# EAGLE design FPC-EMC01-1284 (EAGLE 7.2.0)

## Sheet 1 of 2
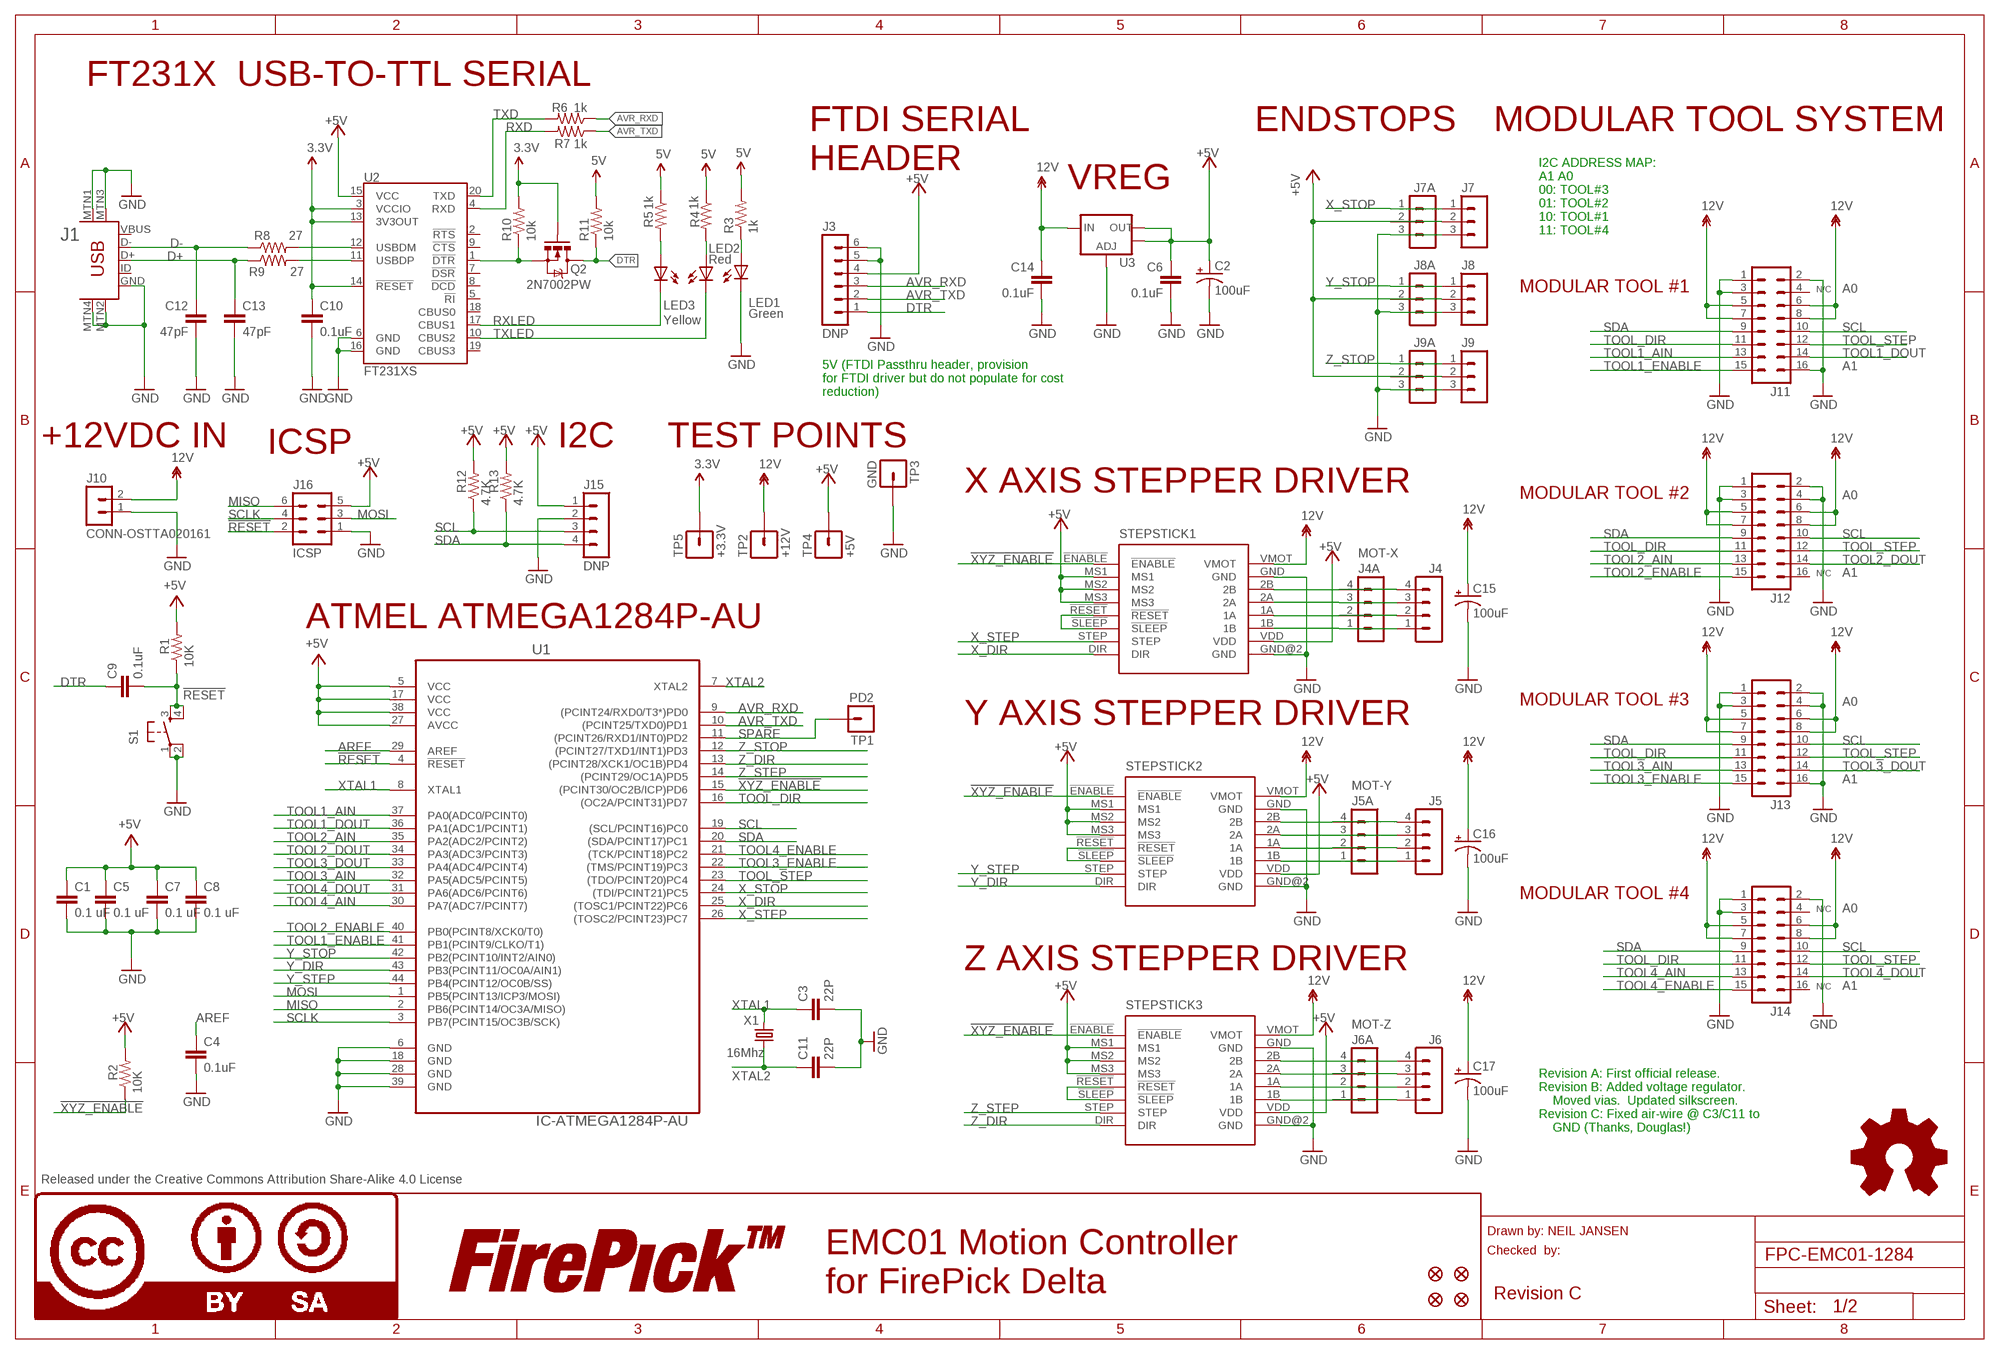
[diagram p0: schematic, sheet 1]

### Parts
C1  0.1 uF  CAP0805  [0805]
C2  100uF  CPOL-USD  [PANASONIC_D]
C3  22P  CAP0805  [0805]
C4  0.1uF  CAP0805  [0805]
C5  0.1 uF  CAP0805  [0805]
C6  0.1uF  CAP0805  [0805]
C7  0.1 uF  CAP0805  [0805]
C8  0.1 uF  CAP0805  [0805]
C9  0.1uF  CAP0805  [0805]
C10  0.1uF  CAP0805  [0805]
C11  22P  CAP0805  [0805]
C12  47pF  CAP0805  [0805]
C13  47pF  CAP0805  [0805]
C14  0.1uF  CAP0805  [0805]
C15  100uF  CPOL-USD  [PANASONIC_D]
C16  100uF  CPOL-USD  [PANASONIC_D]
C17  100uF  CPOL-USD  [PANASONIC_D]
FID1  FIDUCIAL1X2  [FIDUCIAL-1X2]
FID2  FIDUCIAL1X2  [FIDUCIAL-1X2]
FID3  FIDUCIAL1X2  [FIDUCIAL-1X2]
FID4  FIDUCIAL1X2  [FIDUCIAL-1X2]
J1  USB-MINIB-5PIN  [USB-MINIB]
J3  DNP  MA06-1  [MA06-1]
J4  MA04-1  [MA04-1]
J4A  MOT-X  CONN-RECT-4PINJST-PH-2MM  [CONN-JST-PH_2.0MM_4PIN-SMT-RA]
J5  MA04-1  [MA04-1]
J5A  MOT-Y  CONN-RECT-4PINJST-PH-2MM  [CONN-JST-PH_2.0MM_4PIN-SMT-RA]
J6  MA04-1  [MA04-1]
J6A  MOT-Z  CONN-RECT-4PINJST-PH-2MM  [CONN-JST-PH_2.0MM_4PIN-SMT-RA]
J7  MA03-1  [MA03-1]
J7A  CONN-RECT-3PINJST_PH_2MM  [CONN-JST_PH-2.0MM-3PIN-SMT-RA]
J8  MA03-1  [MA03-1]
J8A  CONN-RECT-3PINJST_PH_2MM  [CONN-JST_PH-2.0MM-3PIN-SMT-RA]
J9  MA03-1  [MA03-1]
J9A  CONN-RECT-3PINJST_PH_2MM  [CONN-JST_PH-2.0MM-3PIN-SMT-RA]
J10  CONN-OSTTA020161  [CONN-OSTTA020161]
J11  CONN-RECT-16PIN-2ROW  [CONN-RECT-2.54MM-16PIN-2ROW-SMTH]
J12  CONN-RECT-16PIN-2ROW  [CONN-RECT-2.54MM-16PIN-2ROW-SMTH]
J13  CONN-RECT-16PIN-2ROW  [CONN-RECT-2.54MM-16PIN-2ROW-SMTH]
J14  CONN-RECT-16PIN-2ROW  [CONN-RECT-2.54MM-16PIN-2ROW-SMTH]
J15  DNP  MA04-1  [MA04-1]
J16  ICSP  CONN-RECT-6PIN-2ROW  [CONN-RECT-2.54MM-6-PIN-2ROW-SMTH]
LED1  Green  LED1206-NS  [LED-1206-NO_SILK]
LED2  Red  LED1206-NS  [LED-1206-NO_SILK]
LED3  Yellow  LED1206-NS  [LED-1206-NO_SILK]
LOGO4  LOGO-FIREPICK  [LOGO-FIREPICK]
LOGO5  LOGO-OSHWMEDIUM  [LOGO-OSHW-MEDIUM]
LOGO6  LOGO-CC-BY-SA  [LOGO-CC-BY-SA]
Q2  2N7002PW  MOSFET-NCHANNEL2N7002PW  [SOT323]
R1  10K  RESISTOR0805-RES  [0805]
R2  10K  RESISTOR0805-RES  [0805]
R3  1k  RESISTOR0805-RES  [0805]
R4  1k  RESISTOR0805-RES  [0805]
R5  1k  RESISTOR0805-RES  [0805]
R6  1k  RESISTOR0805-RES  [0805]
R7  1k  RESISTOR0805-RES  [0805]
R8  27  RESISTOR0805-RES  [0805]
R9  27  RESISTOR0805-RES  [0805]
R10  10k  RESISTOR0805-RES  [0805]
R11  10k  RESISTOR0805-RES  [0805]
R12  4.7K  RESISTOR0805-RES  [0805]
R13  4.7K  RESISTOR0805-RES  [0805]
S1  TAC_SWITCHSMD  [TACTILE_SWITCH_SMD]
STEPSTICK1  STEPSTICK  [STEPSTICK]
STEPSTICK2  STEPSTICK  [STEPSTICK]
STEPSTICK3  STEPSTICK  [STEPSTICK]
TP1  PD2  CONN-TESTPOINT  [CON-TESTPOINT]
TP2  +12V  CONN-TESTPOINT  [CON-TESTPOINT]
TP3  GND  CONN-TESTPOINT  [CON-TESTPOINT]
TP4  +5V  CONN-TESTPOINT  [CON-TESTPOINT]
TP5  +3.3V  CONN-TESTPOINT  [CON-TESTPOINT]
U1  IC-ATMEGA1284P-AU  [QFP44]
U2  FT231XS  [SSOP20_L]
U3  V_REG_LM1117SOT223  [SOT223]
X1  16Mhz  CRYSTALCTS406  [CTS406]

### Nets
3.3V: C10.1 Q2.1(G) R10.2 TP5.1 U2.3(VCCIO) U2.13(3V3OUT) U2.14(!RESET)
12V: C14.1 C15.+ C16.+ C17.+ J10.2 J11.5 J11.6 J11.7 J11.8 J12.5 J12.6 J12.7 J12.8 J13.5 J13.6 J13.7 J13.8 J14.5 J14.6 J14.7 J14.8 STEPSTICK1.VMOT STEPSTICK2.VMOT STEPSTICK3.VMOT TP2.1 U3.3(IN)
!RESET: C9.2 J16.2 R1.1 S1.3 S1.4 U1.4(!RESET)
!XYZ_ENABLE: R2.1 STEPSTICK1.!ENABLE! STEPSTICK2.!ENABLE! STEPSTICK3.!ENABLE! U1.15((PCINT30/OC2B/ICP)PD6)
+5V [power]: C1.1 C2.+ C5.1 C6.1 C7.1 C8.1 J3.4 J7.2 J7A.2 J8.2 J8A.2 J9.2 J9A.2 J15.1 J16.5 R1.2 R2.2 R3.2 R4.1 R5.1 R11.2 R12.2 R13.2 STEPSTICK1.MS1 STEPSTICK1.MS2 STEPSTICK1.MS3 STEPSTICK1.VDD STEPSTICK2.MS1 STEPSTICK2.MS2 STEPSTICK2.MS3 STEPSTICK2.VDD STEPSTICK3.MS1 STEPSTICK3.MS2 STEPSTICK3.MS3 STEPSTICK3.VDD TP4.1 U1.5(VCC) U1.17(VCC) U1.27(AVCC) U1.38(VCC) U2.15(VCC) U3.2(OUT) U3.4(OUT) ; supply symbol labelled 5V
AREF: C4.1 U1.29(AREF)
AVR_RXD: J3.3 R6.1 U1.9((PCINT24/RXD0/T3*)PD0)
AVR_TXD: J3.2 R7.1 U1.10((PCINT25/TXD0)PD1)
D+: C13.1 J1.D+ R9.1
D-: C12.1 J1.D- R8.1
DTR: C9.1 J3.1 Q2.3(D) R11.1
DTR_3.3V: Q2.2(S) R10.1 U2.1(!DTR)
GND [power]: C1.2 C2.- C3.2 C4.2 C5.2 C6.2 C7.2 C8.2 C10.2 C11.2 C12.2 C13.2 C14.2 C15.- C16.- C17.- J1.GND J1.MTN1(MTN2) J1.MTN2(MTN3) J1.MTN3(MTN1) J1.MTN4 J3.5 J3.6 J7.3 J7A.3 J8.3 J8A.3 J9.3 J9A.3 J10.1 J11.1 J11.2 J11.3 J11.16 J12.1 J12.2 J12.3 J12.4 J13.1 J13.2 J13.3 J13.4 J13.16 J14.1 J14.2 J14.3 J15.2 J16.1 LED1.C S1.1 S1.2 STEPSTICK1.GND STEPSTICK1.GND@2(GND) STEPSTICK2.GND STEPSTICK2.GND@2(GND) STEPSTICK3.GND STEPSTICK3.GND@2(GND) TP3.1 U1.6(GND) U1.18(GND) U1.28(GND) U1.39(GND) U2.6(GND) U2.16(GND) U3.1(ADJ)
MISO: J16.6 U1.2(PB6(PCINT14/OC3A/MISO))
MOSI: J16.3 U1.1(PB5(PCINT13/ICP3/MOSI))
N$4: LED1.A R3.1
N$11: STEPSTICK1.!RESET! STEPSTICK1.!SLEEP!
N$16: STEPSTICK2.!RESET! STEPSTICK2.!SLEEP!
N$21: LED2.A R4.2
N$22: LED3.A R5.2
N$23: R8.2 U2.12(USBDM)
N$24: STEPSTICK3.!RESET! STEPSTICK3.!SLEEP!
N$25: R9.2 U2.11(USBDP)
RXD: R7.2 U2.4(RXD)
RXLED: LED3.C U2.17(CBUS1)
SCL [power]: J11.10 J12.10 J13.10 J14.10 J15.3 R12.1 U1.19((SCL/PCINT16)PC0)
SCLK: J16.4 U1.3(PB7(PCINT15/OC3B/SCK))
SDA [power]: J11.9 J12.9 J13.9 J14.9 J15.4 R13.1 U1.20((SDA/PCINT17)PC1)
SPARE: TP1.1 U1.11((PCINT26/RXD1/INT0)PD2)
TOOL1_AIN: J11.13 U1.37(PA0(ADC0/PCINT0))
TOOL1_DOUT: J11.14 U1.36(PA1(ADC1/PCINT1))
TOOL1_ENABLE: J11.15 U1.41(PB1(PCINT9/CLKO/T1))
TOOL2_AIN: J12.13 U1.35(PA2(ADC2/PCINT2))
TOOL2_DOUT: J12.14 U1.34(PA3(ADC3/PCINT3))
TOOL2_ENABLE: J12.15 U1.40(PB0(PCINT8/XCK0/T0))
TOOL3_AIN: J13.13 U1.32(PA5(ADC5/PCINT5))
TOOL3_DOUT: J13.14 U1.33(PA4(ADC4/PCINT4))
TOOL3_ENABLE: J13.15 U1.22((TMS/PCINT19)PC3)
TOOL4_AIN: J14.13 U1.30(PA7(ADC7/PCINT7))
TOOL4_DOUT: J14.14 U1.31(PA6(ADC6/PCINT6))
TOOL4_ENABLE: J14.15 U1.21((TCK/PCINT18)PC2)
TOOL_DIR: J11.11 J12.11 J13.11 J14.11 U1.16((OC2A/PCINT31)PD7)
TOOL_STEP: J11.12 J12.12 J13.12 J14.12 U1.23((TDO/PCINT20)PC4)
TXD: R6.2 U2.20(TXD)
TXLED: LED2.C U2.10(CBUS2)
X1A: J4.2 J4A.2 STEPSTICK1.1A
X1B: J4.1 J4A.1 STEPSTICK1.1B
X2A: J4.3 J4A.3 STEPSTICK1.2A
X2B: J4.4 J4A.4 STEPSTICK1.2B
X_DIR: STEPSTICK1.DIR U1.25((TOSC1/PCINT22)PC6)
X_STEP: STEPSTICK1.STEP U1.26((TOSC2/PCINT23)PC7)
X_STOP: J7.1 J7A.1 U1.24((TDI/PCINT21)PC5)
XTAL1: C3.1 U1.8(XTAL1) X1.3
XTAL2: C11.1 U1.7(XTAL2) X1.1
Y1A: J5.2 J5A.2 STEPSTICK2.1A
Y1B: J5.1 J5A.1 STEPSTICK2.1B
Y2A: J5.3 J5A.3 STEPSTICK2.2A
Y2B: J5.4 J5A.4 STEPSTICK2.2B
Y_DIR: STEPSTICK2.DIR U1.43(PB3(PCINT11/OC0A/AIN1))
Y_STEP: STEPSTICK2.STEP U1.44(PB4(PCINT12/OC0B/SS))
Y_STOP: J8.1 J8A.1 U1.42(PB2(PCINT10/INT2/AIN0))
Z1A: J6.2 J6A.2 STEPSTICK3.1A
Z1B: J6.1 J6A.1 STEPSTICK3.1B
Z2A: J6.3 J6A.3 STEPSTICK3.2A
Z2B: J6.4 J6A.4 STEPSTICK3.2B
Z_DIR: STEPSTICK3.DIR U1.13((PCINT28/XCK1/OC1B)PD4)
Z_STEP: STEPSTICK3.STEP U1.14((PCINT29/OC1A)PD5)
Z_STOP: J9.1 J9A.1 U1.12((PCINT27/TXD1/INT1)PD3)
Unconnected: J1.ID J1.VBUS J11.4 J12.16 J14.4 J14.16 U2.2(!RTS) U2.5(!RI) U2.7(!DSR) U2.8(!DCD) U2.9(!CTS) U2.18(CBUS0) U2.19(CBUS3)

### Notes on the sheet
- FT231X  USB-TO-TTL SERIAL
- ENDSTOPS | MODULAR TOOL SYSTEM
- FTDI SERIAL 
  HEADER
- VREG
- I2C ADDRESS MAP:
  A1 A0
  00: TOOL#3
  01: TOOL#2
  10: TOOL#1
  11: TOOL#4
- J1
- MODULAR TOOL #1 | N/C | A0
- A1
- 5V (FTDI Passthru header, provision
  for FTDI driver but do not populate for cost
  reduction)
- +12VDC IN | ICSP | I2C | TEST POINTS
- X AXIS STEPPER DRIVER
- MODULAR TOOL #2 | A0
- N/C | A1
- ATMEL ATMEGA1284P-AU
- MODULAR TOOL #3 | A0
- Y AXIS STEPPER DRIVER
- A1
- MODULAR TOOL #4
- N/C | A0
- Z AXIS STEPPER DRIVER
- N/C | A1
- Revision A: First official release.
  Revision B: Added voltage regulator.  
      Moved vias.  Updated silkscreen.
  Revision C: Fixed air-wire @ C3/C11 to 
      GND (Thanks, Douglas!)
- Released under the Creative Commons Attribution Share-Alike 4.0 License
- Drawn by: NEIL JANSEN
- Checked  by:
- EMC01 Motion Controller
  for FirePick Delta
- Revision C

## Sheet 2 of 2
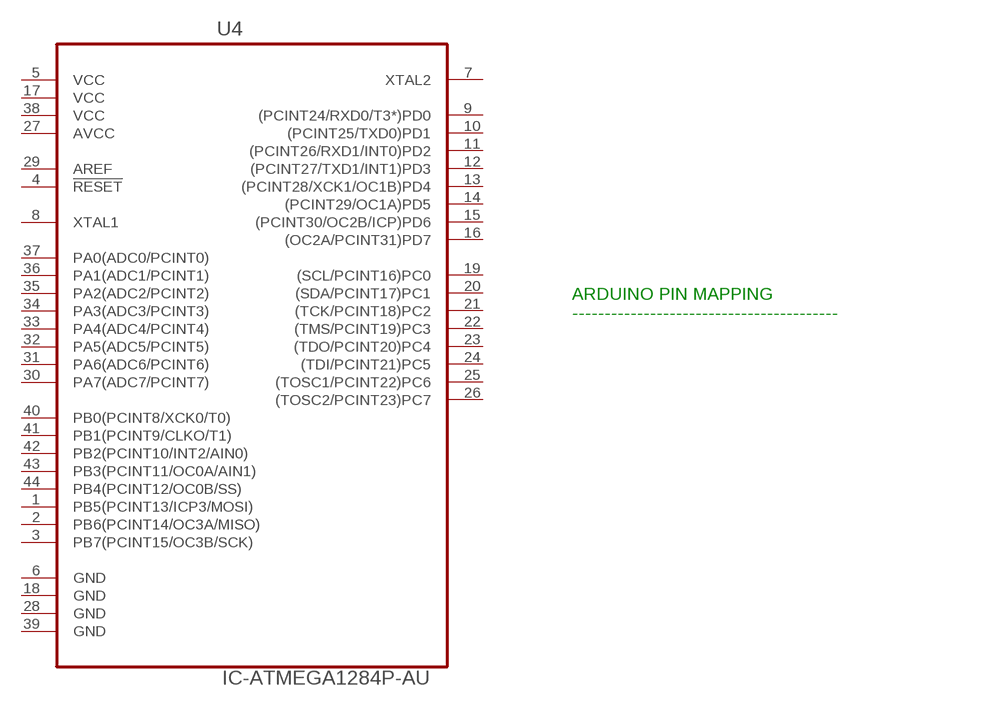
[diagram p1: schematic, sheet 2]

### Parts
U4  IC-ATMEGA1284P-AU  [QFP44]
Unconnected: U4.1(PB5(PCINT13/ICP3/MOSI)) U4.2(PB6(PCINT14/OC3A/MISO)) U4.3(PB7(PCINT15/OC3B/SCK)) U4.4(!RESET) U4.6(GND) U4.7(XTAL2) U4.8(XTAL1) U4.9((PCINT24/RXD0/T3*)PD0) U4.10((PCINT25/TXD0)PD1) U4.11((PCINT26/RXD1/INT0)PD2) U4.12((PCINT27/TXD1/INT1)PD3) U4.13((PCINT28/XCK1/OC1B)PD4) U4.14((PCINT29/OC1A)PD5) U4.15((PCINT30/OC2B/ICP)PD6) U4.16((OC2A/PCINT31)PD7) U4.18(GND) U4.19((SCL/PCINT16)PC0) U4.20((SDA/PCINT17)PC1) U4.21((TCK/PCINT18)PC2) U4.22((TMS/PCINT19)PC3) U4.23((TDO/PCINT20)PC4) U4.24((TDI/PCINT21)PC5) U4.25((TOSC1/PCINT22)PC6) U4.26((TOSC2/PCINT23)PC7) U4.28(GND) U4.29(AREF) U4.30(PA7(ADC7/PCINT7)) U4.31(PA6(ADC6/PCINT6)) U4.32(PA5(ADC5/PCINT5)) U4.33(PA4(ADC4/PCINT4)) U4.34(PA3(ADC3/PCINT3)) U4.35(PA2(ADC2/PCINT2)) U4.36(PA1(ADC1/PCINT1)) U4.37(PA0(ADC0/PCINT0)) U4.39(GND) U4.40(PB0(PCINT8/XCK0/T0)) U4.41(PB1(PCINT9/CLKO/T1)) U4.42(PB2(PCINT10/INT2/AIN0)) U4.43(PB3(PCINT11/OC0A/AIN1)) U4.44(PB4(PCINT12/OC0B/SS))

### Notes on the sheet
- ARDUINO PIN MAPPING
  -----------------------------------------

## Power pins joined to a net without a drawn wire
AVCC: U4.27(AVCC)
VCC: U4.5(VCC) U4.17(VCC) U4.38(VCC)

## Library data of the parts
C1 C3-C14 = SparkFun-Capacitors:CAP: Capacitor Standard 0603 ceramic capacitor, and 0.1" leaded capacitor.
C2 C15-C17 = rcl:CPOL-US: POLARIZED CAPACITOR, American symbol
FID1-FID4 = SparkFun-Aesthetics:FIDUCIAL: Fiducial Alignment Points Various fiducial points for machine vision alignment.
J1 = SparkFun-Connectors:USB-MINIB: Mini-USB "B" connector with 5th pin broken out. Created new symbol breaking out 5th "ID" pin in mini/micro USB connector spec. See: http://en.wikipedia.org/wiki/Mini_usb#Cables. Uses same footprint as 4-pin symbol. Also added pins to connect to mounting / shield pads if required (probably not generally needed as signals aren't shielded once they leave the connector).
J3 = !con-lstb:MA06-1: PIN HEADER
J4-J6 J15 = !con-lstb:MA04-1: PIN HEADER
J4A J5A J6A = FirePick:CONN-RECT-4PIN
J7-J9 = !con-lstb:MA03-1: PIN HEADER
J7A J8A J9A = FirePick:CONN-RECT-3PIN
J10 = FirePick:CONN-OSTTA020161
J11-J14 = FirePick:CONN-RECT-16PIN-2ROW
J16 = FirePick:CONN-RECT-6PIN-2ROW
LED1-LED3 = SparkFun-LED:LED: LEDs Standard schematic elements and footprints for 5mm, 3mm, 1206, and 0603 sized LEDs. 5mm - Spark Fun Electronics SKU : COM-00529 (and others)
LOGO4 = FirePick:LOGO-FIREPICK
LOGO5 = FirePick:LOGO-OSHW
LOGO6 = FirePick:LOGO-CC-BY-SA
Q2 = SparkFun-DiscreteSemi:MOSFET-NCHANNEL: Common NMOSFET Parts MFG P/N Store ID Prod ID FDD8780 TRANS-09984 SI7820DN TRANS-11055 FDS6630A IC-08089 2N7002PW TRANS-11151 FQP30N06L COM-10213 TRANS-10060 BSS123LT1G TRANS-08345 BSS138 TRANS-00830 BS170 2N7000; PROD_ID: TRANS-11151
R1-R13 = SparkFun-Resistors:RESISTOR: Resistor Basic schematic elements and footprints for 0603, 1206, and PTH resistors.
S1 = SparkFun:TAC_SWITCH: Momentary Switch Button commonly used for reset or general input. Spark Fun Electronics SKU : COM-00097
STEPSTICK1-STEPSTICK3 = FirePick:STEPSTICK
TP1-TP5 = FirePick:CONN-TESTPOINT
U1 U4 = FirePick:IC-ATMEGA1284P-AU
U2 = SparkFun-DigitalIC:FT231X: FTDI FT231X Full Speed USB to Full-handshake UART This USB2.0 Full Speed IC offers a compact bridge to full handshake UART interfaces. The device is a UART, capable of operating up to 3MBaud, with low power consumption (8mA). The FT231X includes the complete FT-X series feature set and enables USB to be added into a system design quickly and easily over a UART interface.
U3 = SparkFun-PowerIC:V_REG_LM1117: Voltage Regulator LM1117 Standard adjustable voltage regulator but in SMD form. Spark Fun Electronics SKU : COM-00595
X1 = adafruit:CRYSTAL: CRYSTAL; OC_FARNELL: unknown; OC_NEWARK: unknown

## Net classes
0 default: width 0.152 mm, drill 0.305 mm, clearance 0.152 mm

## Board
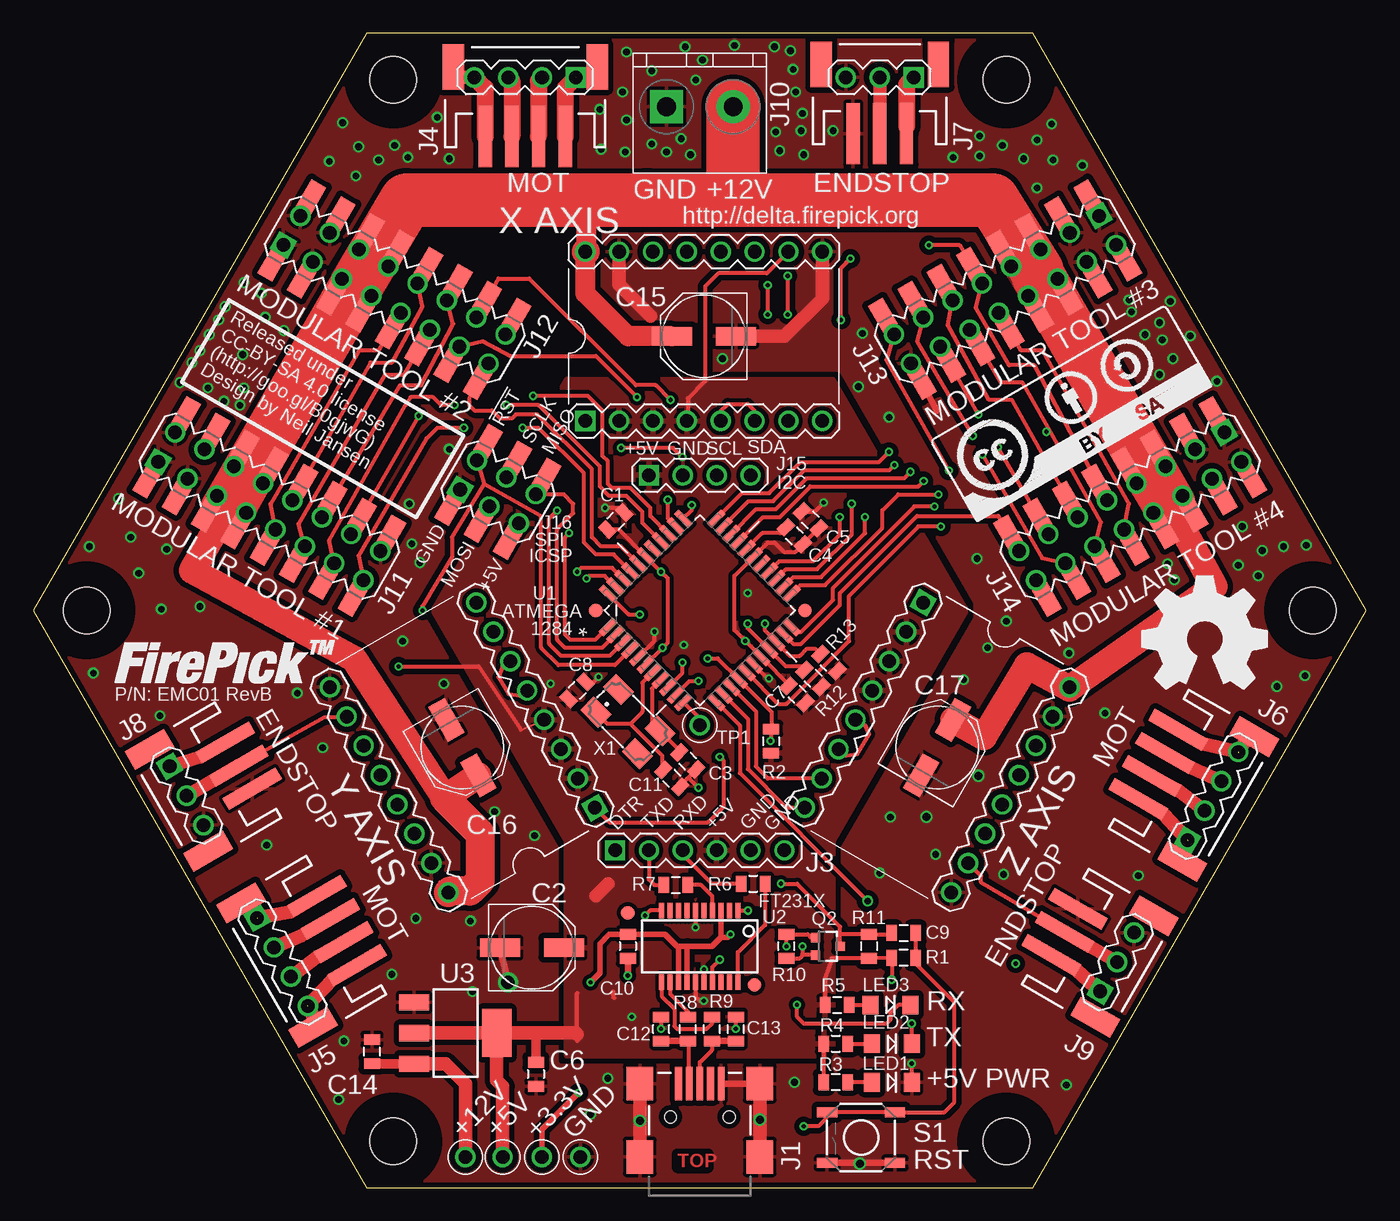
[diagram p2: board, top side]
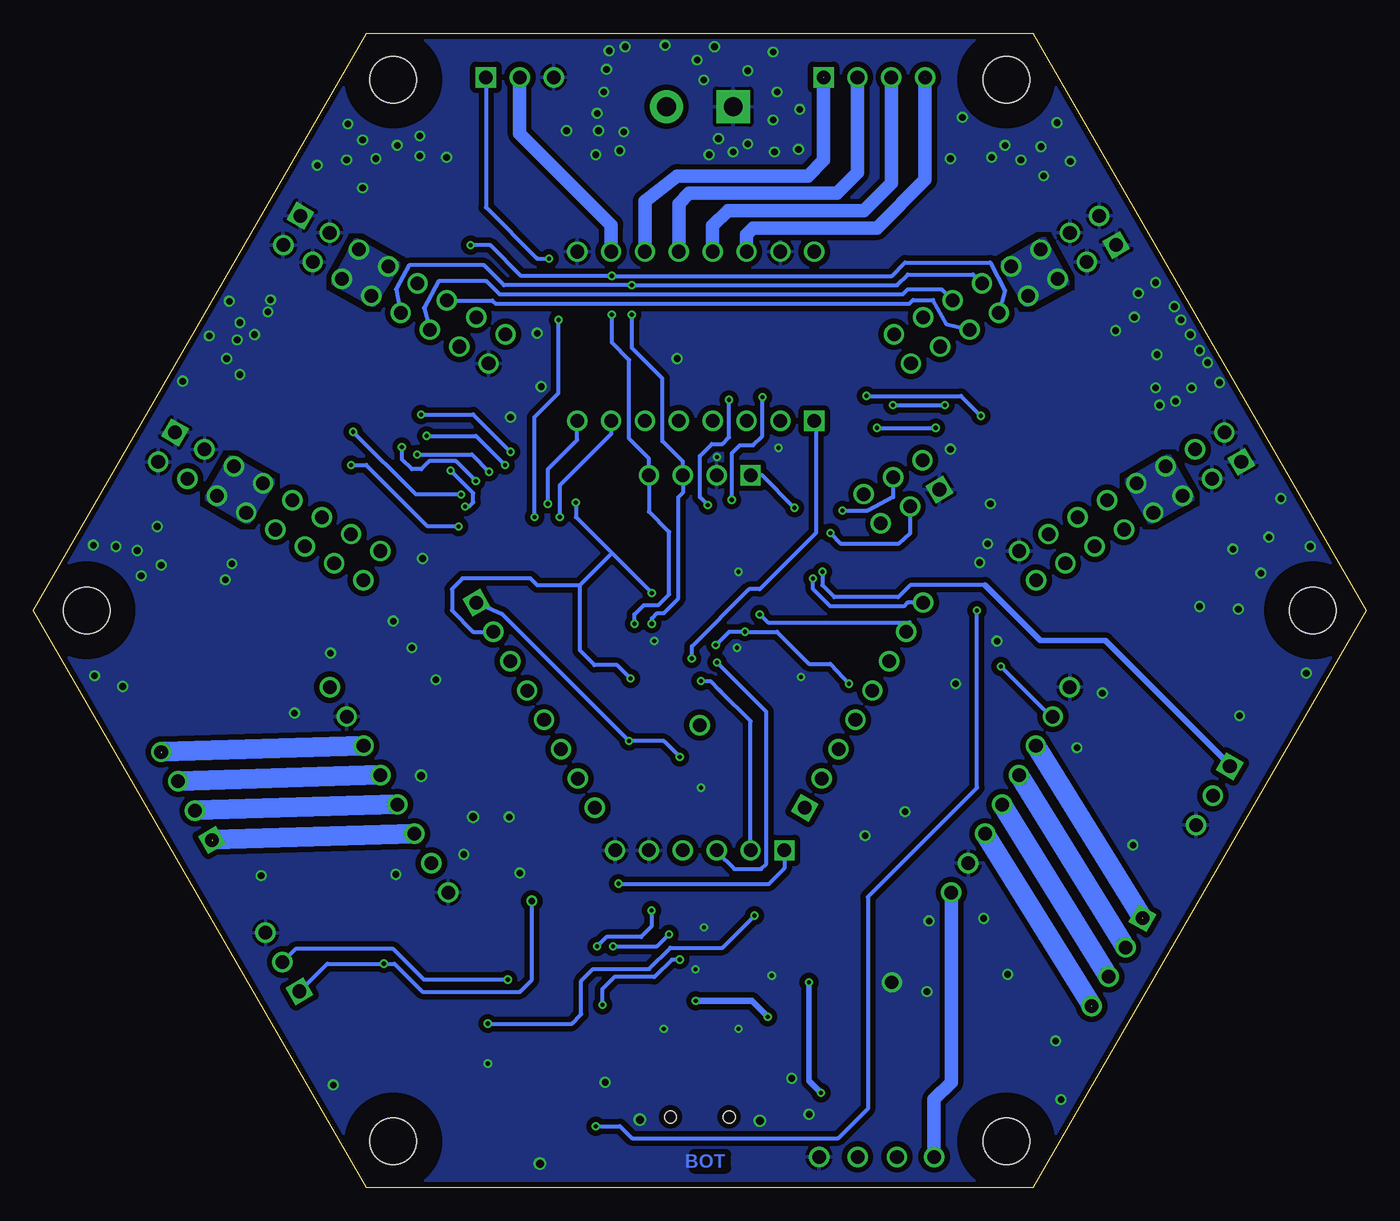
[diagram p3: board, bottom side, seen from below]

Size 100 x 86.6 mm. Coordinates in mm from the lower left corner, seen from the top.
Outline: 25,0 75,0 100,43.3 75,86.6 25,86.6 0,43.3 25,0
Copper layers (1*16): Top 0.035mm / dielectric 1.5mm / Bottom 0.035mm
Design rules "SeeedStudio_2layer_DRU_no_angle_20140221": minimum track width 6mil, minimum drill 12mil, track to track 6mil, track to pad 6mil, pad to pad 6mil, via to via 6mil, smd to smd 0mil, copper to edge 10mil, drill to drill 10mil, minimum pad ring 10mil, minimum via ring 6mil, stop-mask expansion 2mil, vias tented up to drill 100mil, thermal gap 10mil
Holes 3.5 mm at 4,43.3 27,3.46 73,3.46 96,43.3 27,83.14 73,83.14
tRestrict: area 92.8,40.1 to 99.2,46.6; area 0.8,40.1 to 7.2,46.6; area 69.8,0.2 to 76.2,6.7; area 23.8,79.9 to 30.2,86.4; area 69.8,79.9 to 76.2,86.4; area 23.8,0.2 to 30.2,6.7
bRestrict: area 0.8,40.1 to 7.2,46.6; area 69.8,79.9 to 76.2,86.4; area 92.8,40.1 to 99.2,46.6; area 23.8,0.2 to 30.2,6.7; area 69.8,0.2 to 76.2,6.7; area 23.8,79.9 to 30.2,86.4

### Footprints (pad centres in the part's own frame; a part is rotated, then mirrored left to right if it is on the bottom)
0805 = smd 0.8 x 1.2: 1 -0.9,0; 2 0.9,0
PANASONIC_D = smd 3 x 1.4: + 2.4,0; - -2.4,0
FIDUCIAL-1X2 = smd 1 x 1: 1 0,0
USB-MINIB = smd 2.5 x 0.5: D+ 2.5,0; D- 2.5,0.8; GND 2.5,-1.6; ID 2.5,-0.8; VBUS 2.5,1.6 | smd 2.5 x 2: MTN1 -3,4.5; MTN2 2.5,4.5; MTN3 -3,-4.5; MTN4 2.5,-4.5 | hole 0.9: 0,2.2; 0,-2.2
MA06-1 = drill 1.016 square: 1 -6.35,0 | drill 1.016: 2 -3.81,0; 3 -1.27,0; 4 1.27,0; 5 3.81,0; 6 6.35,0
MA04-1 = drill 1.016 square: 1 -3.81,0 | drill 1.016: 2 -1.27,0; 3 1.27,0; 4 3.81,0
CONN-JST-PH_2.0MM_4PIN-SMT-RA = smd 1 x 4.6: 1 3,-2.43; 2 1,-2.43; 3 -1,-2.43; 4 -3,-2.43 | smd 1.6 x 3.4: NC1 -5.4,2.77; NC2 5.4,2.77
MA03-1 = drill 1.016 square: 1 -2.54,0 | drill 1.016: 2 0,0; 3 2.54,0
CONN-JST_PH-2.0MM-3PIN-SMT-RA = smd 1 x 4.6: 1 2.01,-2.23; 2 0.01,-2.23; 3 -1.99,-2.23 | smd 1.6 x 3.4: NC1 -4.39,2.97; NC2 4.41,2.97
CONN-OSTTA020161 = drill 1.4 pad 2.5 square: 1 -2.5,0 | drill 1.4 pad 2.5: 2 2.5,0
CONN-RECT-2.54MM-16PIN-2ROW-SMTH = drill 1.016 square: 1 -8.89,-1.27 | drill 1.016: 2 -8.89,1.27; 3 -6.35,-1.27; 4 -6.35,1.27; 5 -3.81,-1.27; 6 -3.81,1.27; 7 -1.27,-1.27; 8 -1.27,1.27; 9 1.27,-1.27; 10 1.27,1.27; 11 3.81,-1.27; 12 3.81,1.27; 13 6.35,-1.27; 14 6.35,1.27; 15 8.89,-1.27; 16 8.89,1.27 | smd 1.27 x 2.3: P1 -8.89,-2.93; P2 -8.89,2.93; P3 -6.35,-2.93; P4 -6.35,2.93; P5 -3.81,-2.93; P6 -3.81,2.93; P7 -1.27,-2.93; P8 -1.27,2.93; P9 1.27,-2.93; P10 1.27,2.93; P11 3.81,-2.93; P12 3.81,2.93; P13 6.35,-2.93; P14 6.35,2.93; P15 8.89,-2.93; P16 8.89,2.93
CONN-RECT-2.54MM-6-PIN-2ROW-SMTH = drill 1.016 square: 1 -2.54,-1.27 | drill 1.016: 2 -2.54,1.27; 3 0,-1.27; 4 0,1.27; 5 2.54,-1.27; 6 2.54,1.27 | smd 1.27 x 2.3: P1 -2.54,-2.93; P2 -2.54,2.93; P3 0,-2.93; P4 0,2.93; P5 2.54,-2.93; P6 2.54,2.93
LED-1206-NO_SILK = smd 1.2 x 1.4: A -1.5,0; C 1.5,0
SOT323 = smd 0.7 x 0.7: 1 -0.65,-0.925; 2 0.65,-0.925; 3 0,0.925
TACTILE_SWITCH_SMD = smd 1.524 x 0.762: 1 -2.54,1.905; 2 2.54,1.905; 3 -2.54,-1.905; 4 2.54,-1.905
STEPSTICK = drill 1.016: 1A 6.35,-1.27; 1B 6.35,-3.81; 2A 6.35,1.27; 2B 6.35,3.81; !RESET! -6.35,-1.27; !SLEEP! -6.35,-3.81; DIR -6.35,-8.89; GND 6.35,6.35; GND@2 6.35,-8.89; MS1 -6.35,6.35; MS2 -6.35,3.81; MS3 -6.35,1.27; STEP -6.35,-6.35; VDD 6.35,-6.35; VMOT 6.35,8.89 | drill 1.016 square: !ENABLE! -6.35,8.89
CON-TESTPOINT = drill 1.016: 1 0,0
QFP44 = smd 1.473 x 0.508: 1 -5.74,3.988; 2 -5.74,3.2; 3 -5.74,2.388; 4 -5.74,1.6; 5 -5.74,0.787; 6 -5.74,0; 7 -5.74,-0.787; 8 -5.74,-1.6; 9 -5.74,-2.388; 10 -5.74,-3.2; 11 -5.74,-3.988; 23 5.74,-3.988; 24 5.74,-3.2; 25 5.74,-2.388; 26 5.74,-1.6; 27 5.74,-0.787; 28 5.74,0; 29 5.74,0.787; 30 5.74,1.6; 31 5.74,2.388; 32 5.74,3.2; 33 5.74,3.988 | smd 0.508 x 1.473: 12 -3.988,-5.74; 13 -3.2,-5.74; 14 -2.388,-5.74; 15 -1.6,-5.74; 16 -0.787,-5.74; 17 0,-5.74; 18 0.787,-5.74; 19 1.6,-5.74; 20 2.388,-5.74; 21 3.2,-5.74; 22 3.988,-5.74; 34 3.988,5.74; 35 3.2,5.74; 36 2.388,5.74; 37 1.6,5.74; 38 0.787,5.74; 39 0,5.74; 40 -0.787,5.74; 41 -1.6,5.74; 42 -2.388,5.74; 43 -3.2,5.74; 44 -3.988,5.74
SSOP20_L = smd 0.381 x 1.143: 1 -2.857,-2.68; 2 -2.223,-2.68; 3 -1.587,-2.68; 4 -0.953,-2.68; 5 -0.318,-2.68; 6 0.318,-2.68; 7 0.953,-2.68; 8 1.587,-2.68; 9 2.223,-2.68; 10 2.857,-2.68; 11 2.857,2.68; 12 2.223,2.68; 13 1.587,2.68; 14 0.953,2.68; 15 0.318,2.68; 16 -0.318,2.68; 17 -0.953,2.68; 18 -1.587,2.68; 19 -2.223,2.68; 20 -2.857,2.68
SOT223 = smd 1.219 x 2.235: 1 -2.311,-3.099; 2 0,-3.099; 3 2.311,-3.099 | smd 3.6 x 2.2: 4 0,3.099
CTS406 = smd 1.9 x 1.4: 1 -2.2,-1.2; 2 2.2,-1.2; 3 2.2,1.2; 4 -2.2,1.2

### Placement (x,y rotation side)
C1  43.7,50 225 top
C2  37.4,18 0 top
C3  49.1,32 315 top
C4  57.1,48.9 315 top
C5  58.3,50.1 315 top
C6  37.7,8.5 270 top
C7  57.3,37 135 top
C8  40.8,37.3 45 top
C9  65.3,19.1 0 top
C10  44.6,18.1 270 top
C11  47.9,30.7 315 top
C12  47.1,11.9 90 top
C13  52.7,11.9 90 top
C14  25.4,10.2 90 top
C15  50.3,63.87 180 top
C16  32.19,33.02 300 top
C17  67.81,33.02 60 top
FID1  54.1,15.2 0 top
FID2  44.6,20.6 0 top
FID3  57.9,43.3 0 top
FID4  42.2,43.3 0 top
J1  50,5.3 90 top
J3  50,25.3 0 top
J4  36.9,83.3 180 top
J4A  36.9,81.3 0 top
J5  18.69,16.92 300 top
J5A  20.69,18.07 120 top
J6  88.5,29.38 60 top
J6A  86.51,30.53 240 top
J7  63.5,83.3 180 top
J7A  63.5,81.3 0 top
J8  11.5,29.4 300 top
J8A  13.49,30.53 120 top
J9  81.31,16.92 60 top
J9A  79.31,18.07 240 top
J10  50,81.1 0 top
J11  17.7,51.11 330 top
J12  27.09,67.37 330 top
J13  72.91,67.37 210 top
J14  82.3,51.11 210 top
J15  50,53.44 0 top
J16  34.85,52.2 330 top
LED1  64.4,7.9 0 top
LED2  64.4,10.8 0 top
LED3  64.3,13.7 0 top
LOGO4  5.9,36.1 0 top
LOGO5  87.9,41.2 0 top
LOGO6  70.8,49.9 30 top
Q2  59.6,18.1 270 top
R1  65.3,17.23 180 top
R2  55.35,33.5 270 top
R3  60.2,7.9 180 top
R4  60.2,10.8 0 top
R5  60.3,13.7 0 top
R6  54,22.8 0 top
R7  48.2,22.7 0 top
R8  49.1,11.9 90 top
R9  50.9,11.9 90 top
R10  56.5,18.1 90 top
R11  62.7,18.1 270 top
R12  58.5,38.2 315 top
R13  59.7,39.4 315 top
S1  62.1,3.75 180 top
STEPSTICK1  50.3,63.87 90 top
STEPSTICK2  32.19,33.02 210 top
STEPSTICK3  67.81,33.02 330 top
TP1  50,34.7 180 top
TP2  32.41,2.3 0 top
TP3  41.04,2.3 0 top
TP4  35.21,2.3 0 top
TP5  38.16,2.3 0 top
U1  50,43.3 45 top
U2  50,18.1 180 top
U3  31.67,11.59 270 top
U4  8.1,-14.5 0 top  (outside the outline)
X1  44.61,34.96 315 top

### Tracks (layer width: path | path; a pad name or v marks a point on that pad's centre or on a via)
3.3V  (via drill 0.3)
  Top 0.3: 48.3,18.1 48.41,18.1 | 49.05,18.05 49.1,18.1 | v56.5,18.1 R10.2 58.1,19 58.35,18.75 Q2.1
  Top 0.4: U2.3 51.59,18.79 | 51.59,18.79 50.9,18.1 49.1,18.1 48.41,18.1 U2.13 | U2.14 49.05,18.05 | 48.3,18.1 47.4,19 C10.1 43.2,19 42.5,18.3 42.5,16.1 v41.8,15.4 | 51.59,18.79 52.09,18.79 v52.3,19 | TP5.1 38.16,4.36 v40.9,7.1
  Bottom 0.3: v56.5,18.1 53.2,18.1 v52.3,19
  Bottom 0.4: v41.8,15.4 41.8,8 v40.9,7.1
12V
  Top 0.3: J11.8 15.31,52.6 14.5,50.8 | 46.3,74.3 46.1,74.1 | 52.5,75.2 52.2,74.9 52.2,74.5 52.6,74.1
  Top 0.7: C14.1 28.55,9.3 U3.3
  Top 1: TP2.1 32.41,7.79 30.92,9.28 U3.3
  Top 1.5: C15.+ 44.63,63.87 41.41,67.09 STEPSTICK1.VMOT | 41.5,70.22 41.5,74.1 46,74.1
  Top 2: C16.+ 30.86,29.24 24.08,39.64 11.9,46.3 14.5,50.8 | STEPSTICK3.VMOT 77.74,37.44 | 77.74,37.44 74.54,39.18 71.3,33.8 C17.+ | 85.4,50.9 88.6,45.1 77.74,37.44 | STEPSTICK1.VMOT 41.5,70.22
  Top 2.184: 30.86,29.24 33.53,26.57 33.53,23.02 32.77,22.26 31.25,22.26 STEPSTICK2.VMOT
  Top 4: 14.5,50.8 24.7,68.5 28,74.1 46,74.1 46.1,74.1 52.6,74.1 72,74.1 75.3,68.8 | 75.4,68.4 85.2,51.3 | J10.2 52.5,75.2
  Bottom 1: STEPSTICK2.VMOT 31.13,7.89 32.41,6.61 TP2.1
  pour Top (no thermals): 71.8,70.8 75.7,64.1 78.8,65.8 74.9,72.6
  pour Bottom (no thermals): 75.8,71.1 72.6,69.3 74.5,66.2 77.5,67.9
  pour Bottom (no thermals): 85.2,54.8 82,53 83.9,49.9 87,51.7
  pour Bottom (isolate 0.406, no thermals): 13,51.7 14.8,54.9 18,53 16.2,49.9
  pour Bottom (isolate 0.406, no thermals): 22.4,67.9 24.2,71.2 27.4,69.3 25.5,66.2
  pour Top (no thermals): 85.2,55 82,53.1 83.9,50 86.9,51.8
  pour Top (no thermals): 24.5,71.7 22.2,67.9 25.4,66.1 27.6,69.7
  pour Top (no thermals): 15,55.1 13,51.6 16.1,49.8 18,53.3
!RESET  (via drill 0.3)
  Top 0.3: J16.2 33.8,52.8 | 33.8,52.8 38.02,50.41 38.1,50.33 38.1,40.5 39.4,39.2 43.64,39.2 U1.4 | C9.2 R1.1 66.2,16.8 69.1,13.9 69.1,6.4 68.36,5.66 S1.3 S1.4 59.46,5.16 58.9,4.6 v57.8,4.6 | 33.8,52.8 31.4,48.8 31.4,47.3 29.2,43.6 v29.2,43.3
  Bottom 0.3: v57.8,4.6 56,4.6 55.1,3.7 39.6,3.7 37.4,5.9 37.4,21.8 29.2,30 v29.2,43.3
!XYZ_ENABLE  (via drill 0.3)
  Top 0.3: v55.3,33.5 55.35,33.55 R2.1 55.4,34.55 55.4,35.64 U1.15 51.34,39.7 v50.6,39.7 | STEPSTICK2.!ENABLE! 43.22,27.4 50.6,27.4 51.8,28.6 51.8,31.2 51.8,31.5 51.8,32 v51.5,32.3
  Bottom 0.254: STEPSTICK1.!ENABLE! 41.3,57.41
  Bottom 0.3: STEPSTICK3.!ENABLE! 64.84,43.04 v55.3,33.5 52.7,33.5 v51.5,32.3 | v50.6,39.7 50.6,40.6 46.3,44.9 45.5,44.9 41.3,49.1 41.3,57.41
+5V  (via drill 0.3)
  Top 0.152: 36.58,34.35 STEPSTICK2.MS3
  Top 0.3: U2.15 49.68,14.32 50,14 v50.3,14 | C1.1 43.97,51 v42.9,51 | C5.1 58.64,50.74 v59.3,51.4 | U1.17 55.1,38.2 v55.2,38.2 | U1.5 46.6,41.02 v46.6,41.7 | J8A.2 21.9,35.3 23.47,35.3 STEPSTICK2.VDD | J9A.2 71.1,22.9 71.1,23.38 STEPSTICK3.VDD | STEPSTICK1.VDD 55.03,68.6 51.4,68.6 50.4,67.6 50.4,60.5 49.1,59.2 49.1,57.59 STEPSTICK1.MS3 | v27.4,39.1 33.4,39.1 36.58,34.35 | R5.1 59.4,15.7 59.9,17.2 R11.2 R1.2 v64.4,15.6 | 40.8,11 40.8,11.5 40.8,14.6 | 43.4,14.6 43.5,14.7 43.5,14.3 43.6,14.2 | 51.3,25.33 J3.4 | R3.2 R4.1
  Top 0.7: C6.1 37.7,11.49 37.8,11.59
  Top 1: J9.2 J9A.2 | J8.2 J8A.2 | J7A.2 J7.2 | 42.2,21.9 43.1,22.8 | U3.2 U3.4 | U3.4 37.8,11.59 40.71,11.59 40.8,11.5 | U3.4 34.77,8.03 35.21,7.59 TP4.1
  Bottom 0.3: v42.9,51 45.34,53.44 J15.1 | v59.3,51.4 59.3,50.3 56.6,47.6 | 56.6,47.6 v53.6,44.6 | v55.2,38.2 56.2,39.2 57.9,39.2 59,40.3 59,45.2 | 59,45.2 56.6,47.6 | v38.8,37.8 40.2,39.3 41.8,39.3 44.2,41.7 v46.6,41.7 47.8,41.7 v48.8,40.7 | STEPSTICK3.MS1 66.99,41.69 68.6,43.3 68.6,44.9 67.8,45.7 62.7,45.7 62.2,45.2 59,45.2 | STEPSTICK2.VDD 23.64,35.34 v27.4,39.1 | v64.4,15.6 70.7,15.6 73,17.9 80.32,17.9 J9.2
  Bottom 0.5: v50.3,14 46.1,14 v44.9,12.8
  Bottom 1: STEPSTICK1.VDD 56.65,72.21 J7A.2 J7.2
  pour Top (isolate 0.305): 60,60.62 70,43.3 60,25.98 60,9.9 40,9.9 40,25.98 30,43.3 40,60.62
AREF
  Top 0.3: C4.1 56.03,49.1 54.69,49.1 U1.29
AVR_RXD  (via drill 0.3)
  Top 0.3: U1.9 48.7,38.62 v48.7,39.4 | R6.1 50.9,22.8 48.73,24.97 J3.3
  Bottom 0.3: J3.3 48.73,25.23 47.4,23.9 45.4,23.9 45,24.3 45,35.7 v48.7,39.4
AVR_TXD  (via drill 0.3)
  Top 0.3: U1.10 49.23,38 v49.9,38 | J3.2 46.19,23.11 46.6,22.7 R7.1
  Bottom 0.3: v49.9,38 49.2,38 48.55,37.35 48.4,37.2 46.19,34.99 J3.2
D+
  Top 0.3: J1.D+ 50,9.4 50.9,10.3 R9.1
  Top 0.5: C13.1 R9.1
D-
  Top 0.3: J1.D- 49.2,10.9 R8.1
  Top 0.5: C12.1 R8.1
DTR  (via drill 0.3)
  Top 0.3: C9.1 64.3,19 R11.1 60.52,19 | Q2.3 60.52,19 | 60.52,19 60.52,19.58 57.3,22.8 v56.1,22.8
  Bottom 0.3: v56.1,22.8 44.8,22.8 43.65,23.95 J3.1
DTR_3.3V  (via drill 0.3)
  Top 0.3: U2.1 v53.62,20.78 | Q2.2 57.75,17.45 | 57.75,17.45 57.5,17.2 R10.1 | v57.7,18.1 57.7,17.5 57.75,17.45
  Bottom 0.3: v57.7,18.1 57,18.8 54.4,18.8 53.62,19.58 v53.62,20.78
GND  (via drill 0.3, 0.5, 0.6, 1)
  Top 0.3: U2.6 v49.68,19.52 | U2.16 v50.32,16.38 | C12.2 v47.1,11.9 | v52.7,11.9 C13.2 | LED1.C v65.9,9.3 | v47.1,46.2 U1.39 43.94,49.37 C1.2 | v47.1,46.2 | U1.6 v47.2,40.5 47.6,40.9 47.6,45.7 v47.1,46.2 | C7.2 56.76,37.65 U1.18 v53.41,41 52.6,41.82 52.6,45.9 U1.28 55.1,48.4 55.6,48.4 56.3,47.7 57.17,47.7 C4.2 C5.2 | v48.7,54.8 48,55.5 v44.1,55.5 | C8.2 42.04,37.94 v42.4,38.3 | C3.2 49.04,30.66 | 49.04,30.66 48.54,30.16 C11.2 48.54,30.04 | v49.9,30 49.24,30.66 49.04,30.66
  Top 0.5: S1.2 61.95,1.85 v62,1.8 62.05,1.85 S1.1 | C10.2 v44.6,15.9 | J1.GND J1.MTN4 | C2.- v35.6,15.4 | J13.16 67.8,58.3
  Top 1: C15.- 56.37,63.87 59.19,66.69 STEPSTICK1.GND@2 | J1.MTN3 v54.5,5.1 J1.MTN4 | STEPSTICK1.GND 43.95,67.75 46.3,65.4
  Top 1.016: J1.MTN2 v45.5,5 J1.MTN1
  other vias: 67,27.8 23.2,79.9 24.2,75.9 22.2,77 24.4,78.1 27.1,78.2 31.2,77.2 30.3,80.3 15.8,67.9 4.2,48.1 7.3,48.8 10,47.9 7.9,46.1 12.5,43.6 9.6,43.4 25.9,77.1 42.5,80.9 44.2,82.2 48.9,85.6 52.6,85.7 56.8,85.3 76.4,79.8 75.3,78.6 72.7,78.2 71,78.9 69,77.3 71,77.4 74.3,77.2 75.3,75 78.7,76.7 76.5,77.1 28.1,77.3 82.4,65.7 11.9,61.9 17.1,67.1 17.4,65.3 13.9,65.1 15.7,62.5 13.2,64 12.5,62.8 15.5,58.7 15.8,60 11,60.4 13.1,60 18.8,64.3 14.4,66.1 14.3,59 6.4,51.7 82.2,66.6 85.3,66.5 84.5,61 84.7,63.6 83.4,64 85.5,62.2 88.8,60.5 86.8,63.9 84.5,64.9 95.5,48.2 91.9,45.9 90.4,46.7 92.2,47.8 93.8,48.1 90.7,49.6 62.2,64.1 64.2,57.8 61.9,60.1 85.6,45.6 85.1,46.8 77.7,40.1 69.8,38.1 71.6,40.5 73,42.5 70.8,47.2 17.5,25.7 26.9,16 28.7,20.2 32.95,14.7 77.5,7.7 82.9,23.4 72.8,23.5 63.5,23.6 19.8,37.1 37.6,26.4 34.6,28.2 30.8,37.8 64.3,27.8 51.7,62.2 28.4,48.3 29,46.9 31.2,55.4 28.2,51.3 41.8,5.5 57.1,7.9 43.1,8.2 32.8,20 67.7,25 27.7,41 21.7,33 9.5,35.4 4.5,38.6 95.4,38.4 93.3,37.6 80.4,35.6 70.9,30.9 23.3,11 22.9,6.6 44.4,77.7 48.6,78.7 46.4,78.3 44.5,80.1 42.6,77.9 44.5,85.2 46.4,83.8 49.7,83.1 56,77.8 57.8,77.5 60,79.3 55.7,79.2 57.7,80.6 57.2,82.2 55.6,85.6 47.5,77.7 49.3,77.5 50.2,84.6 57,83.9 57.6,79.3
  pour Bottom (isolate 0.406, rank 2): 25,86.6 0,43.2 25,-0.1 75,0 100,43.3 75,86.6
  pour Top (isolate 0.406, rank 2): 25.1,86.6 0.1,43.2 25.1,-0.1 75.1,0 100.1,43.3 75.1,86.6
MISO
  Top 0.3: J16.6 39.77,52.03 40.5,51.3 40.5,50.6 39.3,49.4 39.3,41.1 39.9,40.5 42.67,40.5 U1.2
MOSI  (via drill 0.3)
  Top 0.3: v40.2,49.1 39.9,48.8 39.9,41.5 40.3,41.1 42.16,41.1 U1.1
  Bottom 0.3: J16.3 34.22,49.08 35.1,48.3 39.4,48.3 v40.2,49.1
N$4
  Top 0.3: LED1.A R3.1
N$11
  Top 0.3: STEPSTICK1.!RESET! 51.57,58.27 52.1,58.8 53.6,58.8 54.1,58.3 STEPSTICK1.!SLEEP!
N$16
  Top 0.3: STEPSTICK2.!RESET! 36.5,36.9 35.7,37 34.9,38.3 35.2,39.1 STEPSTICK2.!SLEEP!
N$21
  Top 0.3: R4.2 LED2.A
N$22
  Top 0.3: 61.1,13.7 R5.2 LED3.A
N$23
  Top 0.3: R8.2 49.1,13.2 47.78,14.52 U2.12
N$24
  Top 0.3: STEPSTICK3.!SLEEP! 61,32.4 61.8,32.5 62.7,34 62.4,34.7 STEPSTICK3.!RESET!
N$25
  Top 0.3: U2.11 47.14,14.36 48.1,13.4 48.1,12.1 48.3,11.9 50.5,11.9 50.9,12.3 R9.2
RXD
  Top 0.3: U2.4 50.95,21.85 50.1,22.7 R7.2
RXLED  (via drill 0.3)
  Top 0.3: U2.17 50.95,16.55 v51.5,17.1 | LED3.C 64.9,13.7 64.3,13.1 64.3,12.6 64,12.3 57.8,12.3 57.3,12.8 v57.3,13.7
  Bottom 0.3: v51.5,17.1 52.1,17.1 53.4,15.8 56.4,15.8 57.3,14.9 v57.3,13.7
SCL  (via drill 0.3)
  Top 0.3: R12.1 57.6,39.1 56.46,39.1 U1.19 53.6,41.96 v53.6,42.3 | J11.10 25.3,61.9 26.9,61.9 29.2,66.1 J12.10 | J14.10 82.2,51.3 75.7,62.8 74.1,62.8 J13.10 | v55.1,65.5 v55.1,67.7
  Bottom 0.3: v53.6,42.3 53.6,42.7 53.2,43.1 52.7,43.1 51.6,44.2 51.6,51.8 51.27,52.13 J15.3 51.27,54.47 52.8,56 52.8,60.7 55.1,63 v55.1,65.5 | J12.10 29.5,68.5 34.4,68.5 35.2,67.7 v55.1,67.7 64.7,67.7 66.2,69.2 71.8,69.2 72.8,67.4 J13.10
SCLK  (via drill 0.3)
  Top 0.3: v39.3,50.8 38.7,50.2 38.7,40.8 39.6,39.9 43.22,39.9 U1.3
  Bottom 0.3: v39.3,50.8 39.2,50.8 37.4,50.8 35.5,51.8 35.49,51.81 J16.4
SDA  (via drill 0.3)
  Top 0.3: R13.1 58.7,40.4 58,40.4 57.5,39.9 56.78,39.9 U1.20 54.9,41.78 v54.9,42.3 | J11.9 17.8,51.3 24.4,62.72 24.5,62.8 25.9,62.8 J12.9 | J14.9 75.1,61.7 73.2,61.7 70.7,66 J13.9 69.5,70.7 v67.2,70.7 | v56.6,65.5 v56.6,68.4
  Bottom 0.3: v54.9,42.3 54.9,43 54.2,43.7 53.1,43.7 52.3,44.5 52.3,49.2 53.81,50.71 J15.4 53.81,54.71 55.3,56.2 55.3,62.1 56.6,63.4 v56.6,65.5 | J12.9 27.1,67.3 28.2,69.4 34.6,69.4 35.6,68.4 v56.6,68.4 63.4,68.4 65.7,70.7 v67.2,70.7
SPARE
  Top 0.3: U1.11 50,35.18 TP1.1
TOOL1_AIN  (via drill 0.3)
  Top 0.3: U1.37 45.7,49.86 45.7,50.7 44.5,51.9 43.2,51.9 42.5,52.6 42.5,54.1 37.9,58.7 v35.5,58.7 | J11.13 22.2,48.6 27.9,58.7 28.3,59.3 30,59.3 30.6,58.7 v31.6,58.7
  Bottom 0.3: v35.5,58.7 v31.6,58.7
TOOL1_DOUT  (via drill 0.3)
  Top 0.3: U1.36 46.3,50.38 46.3,51 44.8,52.5 43.4,52.5 43.1,52.8 43.1,54.5 42.7,54.9 42.7,58.3 41.6,59.4 v37.5,59.4 | J11.14 v28.9,57.9
  Bottom 0.3: v37.5,59.4 30.4,59.4 v28.9,57.9
TOOL1_ENABLE  (via drill 0.3)
  Top 0.3: U1.41 43.54,47.5 42.2,47.5 41.3,48.4 41.3,53.6 37.9,57 v36.7,57 | v32.3,57 30.3,57 29.5,56.2 24.4,47.4 J11.15
  Bottom 0.3: v36.7,57 v32.3,57
TOOL2_AIN  (via drill 0.3)
  Top 0.3: U1.35 47.6,50.23 v47.6,51.6 | v45.3,59.3 42.2,62.4 35.8,62.4 33.7,63.5 J12.13
  Bottom 0.3: v47.6,51.6 47.6,55.1 47,55.7 46,55.7 45.3,56.4 v45.3,59.3
TOOL2_DOUT  (via drill 0.3)
  Top 0.3: v47.8,59.1 46.7,60.2 45.2,60.2 37.2,68.2 34.9,68.2 J12.14 | U1.34 49.4,50.82 v49.4,51.2
  Bottom 0.3: v47.8,59.1 47.8,56.3 48.3,55.8 49.1,55.8 50,54.9 50,51.8 v49.4,51.2
TOOL2_ENABLE
  Top 0.3: U1.40 44.09,48.1 42.6,48.1 41.9,48.8 41.9,53.9 37.8,58 36.2,58 35.9,57.7 35,57.7 34.4,58.3 33.1,58.3 32.7,58.7 32.7,59.2 J12.15
TOOL3_AIN  (via drill 0.3)
  Top 0.3: U1.32 53.67,51.5 55.5,51.5 57.8,53.8 64.2,53.8 v64.6,54.2 | J13.13 66.3,63.5 v70.5,56.4
  Bottom 0.3: v70.5,56.4 66.8,56.4 v64.6,54.2
TOOL3_DOUT  (via drill 0.3)
  Top 0.3: U1.33 53.16,52.1 55.2,52.1 57.5,54.4 63.4,54.4 v64.2,55.2 | J13.14 v70.9,58
  Bottom 0.3: v70.9,58 67,58 v64.2,55.2
TOOL3_ENABLE  (via drill 0.3)
  Top 0.3: U1.22 57.24,41.7 57.6,41.7 60,44.1 60,45 66.1,51.1 v67.6,51.1 | v68.7,53.8 64,62.1 J13.15
  Bottom 0.3: v67.6,51.1 67.3,51.1 67,51.4 67,52.1 v68.7,53.8
TOOL4_AIN  (via drill 0.3)
  Top 0.3: U1.30 54.74,50.3 56,50.3 58.3,52.6 66.4,52.6 v66.8,53 | J14.13 72.38,55.53 v72.35,55.57
  Bottom 0.3: v72.35,55.57 72.35,54.65 71.6,53.9 70.9,53.9 70.3,54.5 68.3,54.5 v66.8,53
TOOL4_DOUT  (via drill 0.3)
  Top 0.3: U1.31 54.22,50.9 55.7,50.9 58,53.2 65.3,53.2 v65.8,53.7 | J14.14 75.7,47.2 v71.2,55
  Bottom 0.3: v71.2,55 67.1,55 v65.8,53.7
TOOL4_ENABLE
  Top 0.3: U1.21 57.03,40.8 57.6,40.8 60.5,43.7 60.5,44.6 66.3,50.4 72.4,50.4 J14.15
TOOL_DIR  (via drill 0.3)
  Top 0.3: U1.16 55.89,36.3 56.5,36.3 61.2,41 61.2,44.4 66.4,49.6 v68.1,49.6 | J11.11 19.9,49.8 26.4,61 27.8,61 J12.11 | J14.11 v76.15,54.22 73.4,59.1 71.7,59.1 68.6,64.7 J13.11
  Bottom 0.3: J13.11 65.56,66.56 65.3,66.3 34.3,66.3 34,66.6 32.5,66.6 31.5,64.8 J12.11 | v68.1,49.6 70.4,49.6 75.02,54.22 v76.15,54.22
TOOL_STEP  (via drill 0.3)
  Top 0.3: U1.23 57.54,45.2 59.4,45.2 63.7,49.5 63.7,50.8 64.9,52 v67.9,52 | J11.12 27.5,60.2 29.1,60.2 31.5,64.8 J12.12 | J14.12 80.1,49.9 76.29,56.68 | 76.29,56.68 74.2,60.4 72.6,60.4 J13.12 | v76,56.7 76.29,56.68
  Bottom 0.3: J13.12 70.7,66 69.6,68 66,68 65,67 34.8,67 34.4,67.4 31.87,67.4 J12.12 | v67.9,52 71.3,52 v76,56.7
TXD
  Top 0.3: R6.2 54.9,19.7 52.86,17.66 U2.20
TXLED  (via drill 0.3)
  Top 0.3: U2.10 46.28,20.78 v45.9,20.4 | LED2.C v65.9,12.3
  Bottom 0.3: v45.9,20.4 48.3,18 52.2,18 53.8,16.4 58,16.4 58.9,15.5 58.9,13 59.6,12.3 v65.9,12.3
VCC  (2 unrouted)
X1A
  Top 1: J4A.2 37.9,81.1
  Top 1.27: J4.2 37.9,83.03 J4A.2
  Bottom 1: STEPSTICK1.1A 51.57,73.83 50.8,74.6 39.7,74.6 38.17,76.13 J4.2
X1B  (1 unrouted)
  Top 1: J4A.1 39.9,81 | J4.1 42.2,83.3
  Top 1.27: J4.1 39.9,82.49 J4A.1
  Bottom 1: STEPSTICK1.1B 54.11,73.99 51.7,75.9 41.9,75.9 40.71,77.09 J4.1
X2A
  Top 1: J4A.3 35.9,81.03
  Top 1.27: J4.3 35.9,83.03 J4A.3
  Bottom 1: STEPSTICK1.2A 49.03,72.17 47.9,73.3 37.7,73.3 35.63,75.37 J4.3
X2B  (1 unrouted)
  Top 1: J4A.4 33.9,80.7 | J4.4 31.6,83.3
  Top 1.27: J4.4 33.9,82.49 J4A.4
  Bottom 1: STEPSTICK1.2B 46.49,71.51 46,72 36.7,72 33.09,75.61 J4.4
X_DIR  (via drill 0.3)
  Top 0.3: U1.25 56.48,46.4 58.8,46.4 61.4,49 v61.4,51.3
  Bottom 0.3: v61.4,51.3 61.4,53.9 59.2,56.1 STEPSTICK1.DIR
X_STEP  (via drill 0.3)
  Top 0.3: U1.26 55.96,47 58.5,47 60.5,49 v60.5,50.3
  Bottom 0.3: v60.5,50.3 60.5,52.7 56.65,56.55 STEPSTICK1.STEP
X_STOP  (via drill 0.3)
  Top 0.3: U1.24 57.03,45.8 59.1,45.8 62.4,49.1 v62.4,50.3 | 61,69.4 v61.3,69.7 60.6,69 v60.6,65.1
  Top 1: 65.5,81.2 65.51,79.66 J7A.1
  Top 1.27: J7.1 65.51,82.77 65.51,79.66
  Bottom 0.3: J7.1 66.04,73.54 62.2,69.7 v61.3,69.7 | v62.4,50.3 62.4,57.8 60.6,59.6 v60.6,65.1
XTAL1
  Top 0.3: U1.8 46.4,37.44 46.4,34.87 X1.3 48.46,32.8 C3.1
XTAL2
  Top 0.3: U1.7 45.7,37.89 45.7,35.7 44.8,34.8 | C11.1 47.2,31.4 47.2,32.4 44.8,34.8 | 44.8,34.8 43.07,34.8 X1.1
Y1A
  Top 1: J5.2 20.1,18.9 J5A.2
  Bottom 1.5: STEPSTICK2.1A J5.2
Y1B  (1 unrouted)
  Top 1: J5.1 19.3,20.7 J5A.1 | 16.8,20.2 16.2,21.4
  Bottom 0.3: 16.78,20.24 J5.1 16.76,20.25 16.76,20.28
  Bottom 1.5: STEPSTICK2.1B J5.1
Y2A
  Top 1: J5.3 21.3,17.3 J5A.3
  Bottom 1.5: STEPSTICK2.2A J5.3
Y2B  (1 unrouted)
  Top 1: J5.4 22.4,15.6 J5A.4 | 20.6,13.6 21.4,12.1
  Bottom 1.5: STEPSTICK2.2B J5.4
Y_DIR  (via drill 0.3)
  Top 0.3: U1.43 42.87,45.9 41.7,45.9 v41.5,45.7
  Bottom 0.3: v41.5,45.7 41.5,44.9 40.2,43.6 34.7,43.6 34.41,43.89 STEPSTICK2.DIR
Y_STEP  (via drill 0.3)
  Top 0.3: U1.44 44.66,43 v45.5,43
  Bottom 0.3: STEPSTICK2.STEP 34.24,42.4 44.9,42.4 v45.5,43
Y_STOP  (via drill 0.3, 0.6)
  Top 0.3: U1.42 43.42,46.5 41.1,46.5 v40.8,46.2
  Top 1: J8.1 12.5,32.3 J8A.1
  Bottom 0.3: v40.8,46.2 40.8,45.2 39.9,44.3 35.1,44.3 34.2,45.2 28.6,45.2
  Bottom 0.406: J8.1 10.23,31.73 19.56,41.05 24.45,41.05 28.6,45.2
  other vias: 10.23,31.6
Z1A
  Top 1: J6A.2 85.9,29.8 J6.2
  Bottom 1.5: STEPSTICK3.1A J6.2
Z1B  (1 unrouted)
  Top 1: J6A.1 84.8,28 J6.1 | 86.6,26 85.9,24.6
  Bottom 1.5: STEPSTICK3.1B J6.1
Z2A
  Top 1: J6A.3 86.9,31.5 J6.3
  Bottom 1.5: STEPSTICK3.2A J6.3
Z2B  (1 unrouted)
  Top 1: J6A.4 87.8,33.3 J6.4 | 90.4,32.6 91.2,34
  Bottom 1.5: STEPSTICK3.2B J6.4
Z_DIR
  Top 0.3: U1.13 53.6,35.18 53.6,31.4 56.51,28.49 STEPSTICK3.DIR
Z_STEP
  Top 0.3: U1.14 54.2,35.72 54.2,31.6 55.11,30.69 STEPSTICK3.STEP
Z_STOP  (via drill 0.3, 0.5)
  Top 0.3: U1.12 53,34.66 53,31.1 62.2,21.9 v62.6,21.5
  Top 1: J9A.1 78.3,16.3 J9.1
  Bottom 0.3: J9.1 77.95,16.8 v73.7,16.8 72.9,16.8 70.8,14.7 63.5,14.7 62.6,15.6 v62.6,21.5

### Text on the board
Top: TOP
Bottom: BOT
tPlace: MOT | GND | +12V | ENDSTOP | http://delta.firepick.org | X AXIS | MODULAR TOOL #2 | Released under / CC-BY-SA 4.0 license / (http://goo.gl/B0gjwG) / Design by Neil Jansen | !RST | MODULAR TOOL #3 | SCLK | MISO | +5V | GND | SCL | SDA | I2C | MODULAR TOOL #1 | GND | MOSI | SPI | +5V | ICSP | ATMEGA | 1284 | MODULAR TOOL #4 | P/N: EMC01 RevB | ENDSTOP | MOT | DTR | TXD | RXD | +5V | GND | GND | Y AXIS | Z AXIS | MOT | FT231X | ENDSTOP | RX | TX | +5V PWR | +12V | +5V | +3.3V | GND | RST